# EasyEDA Pro project EasyEDA.epro

# Schematic Schematic1
Board Name: Board1; Create Date: 2025-05-21; Page Name: P1; Project Name: FM_Transmitter; Schematic Name: Schematic1; Update Date: 2025-06-13; Company: EasyEDA.com; Page Size: A4; Version: V1.0
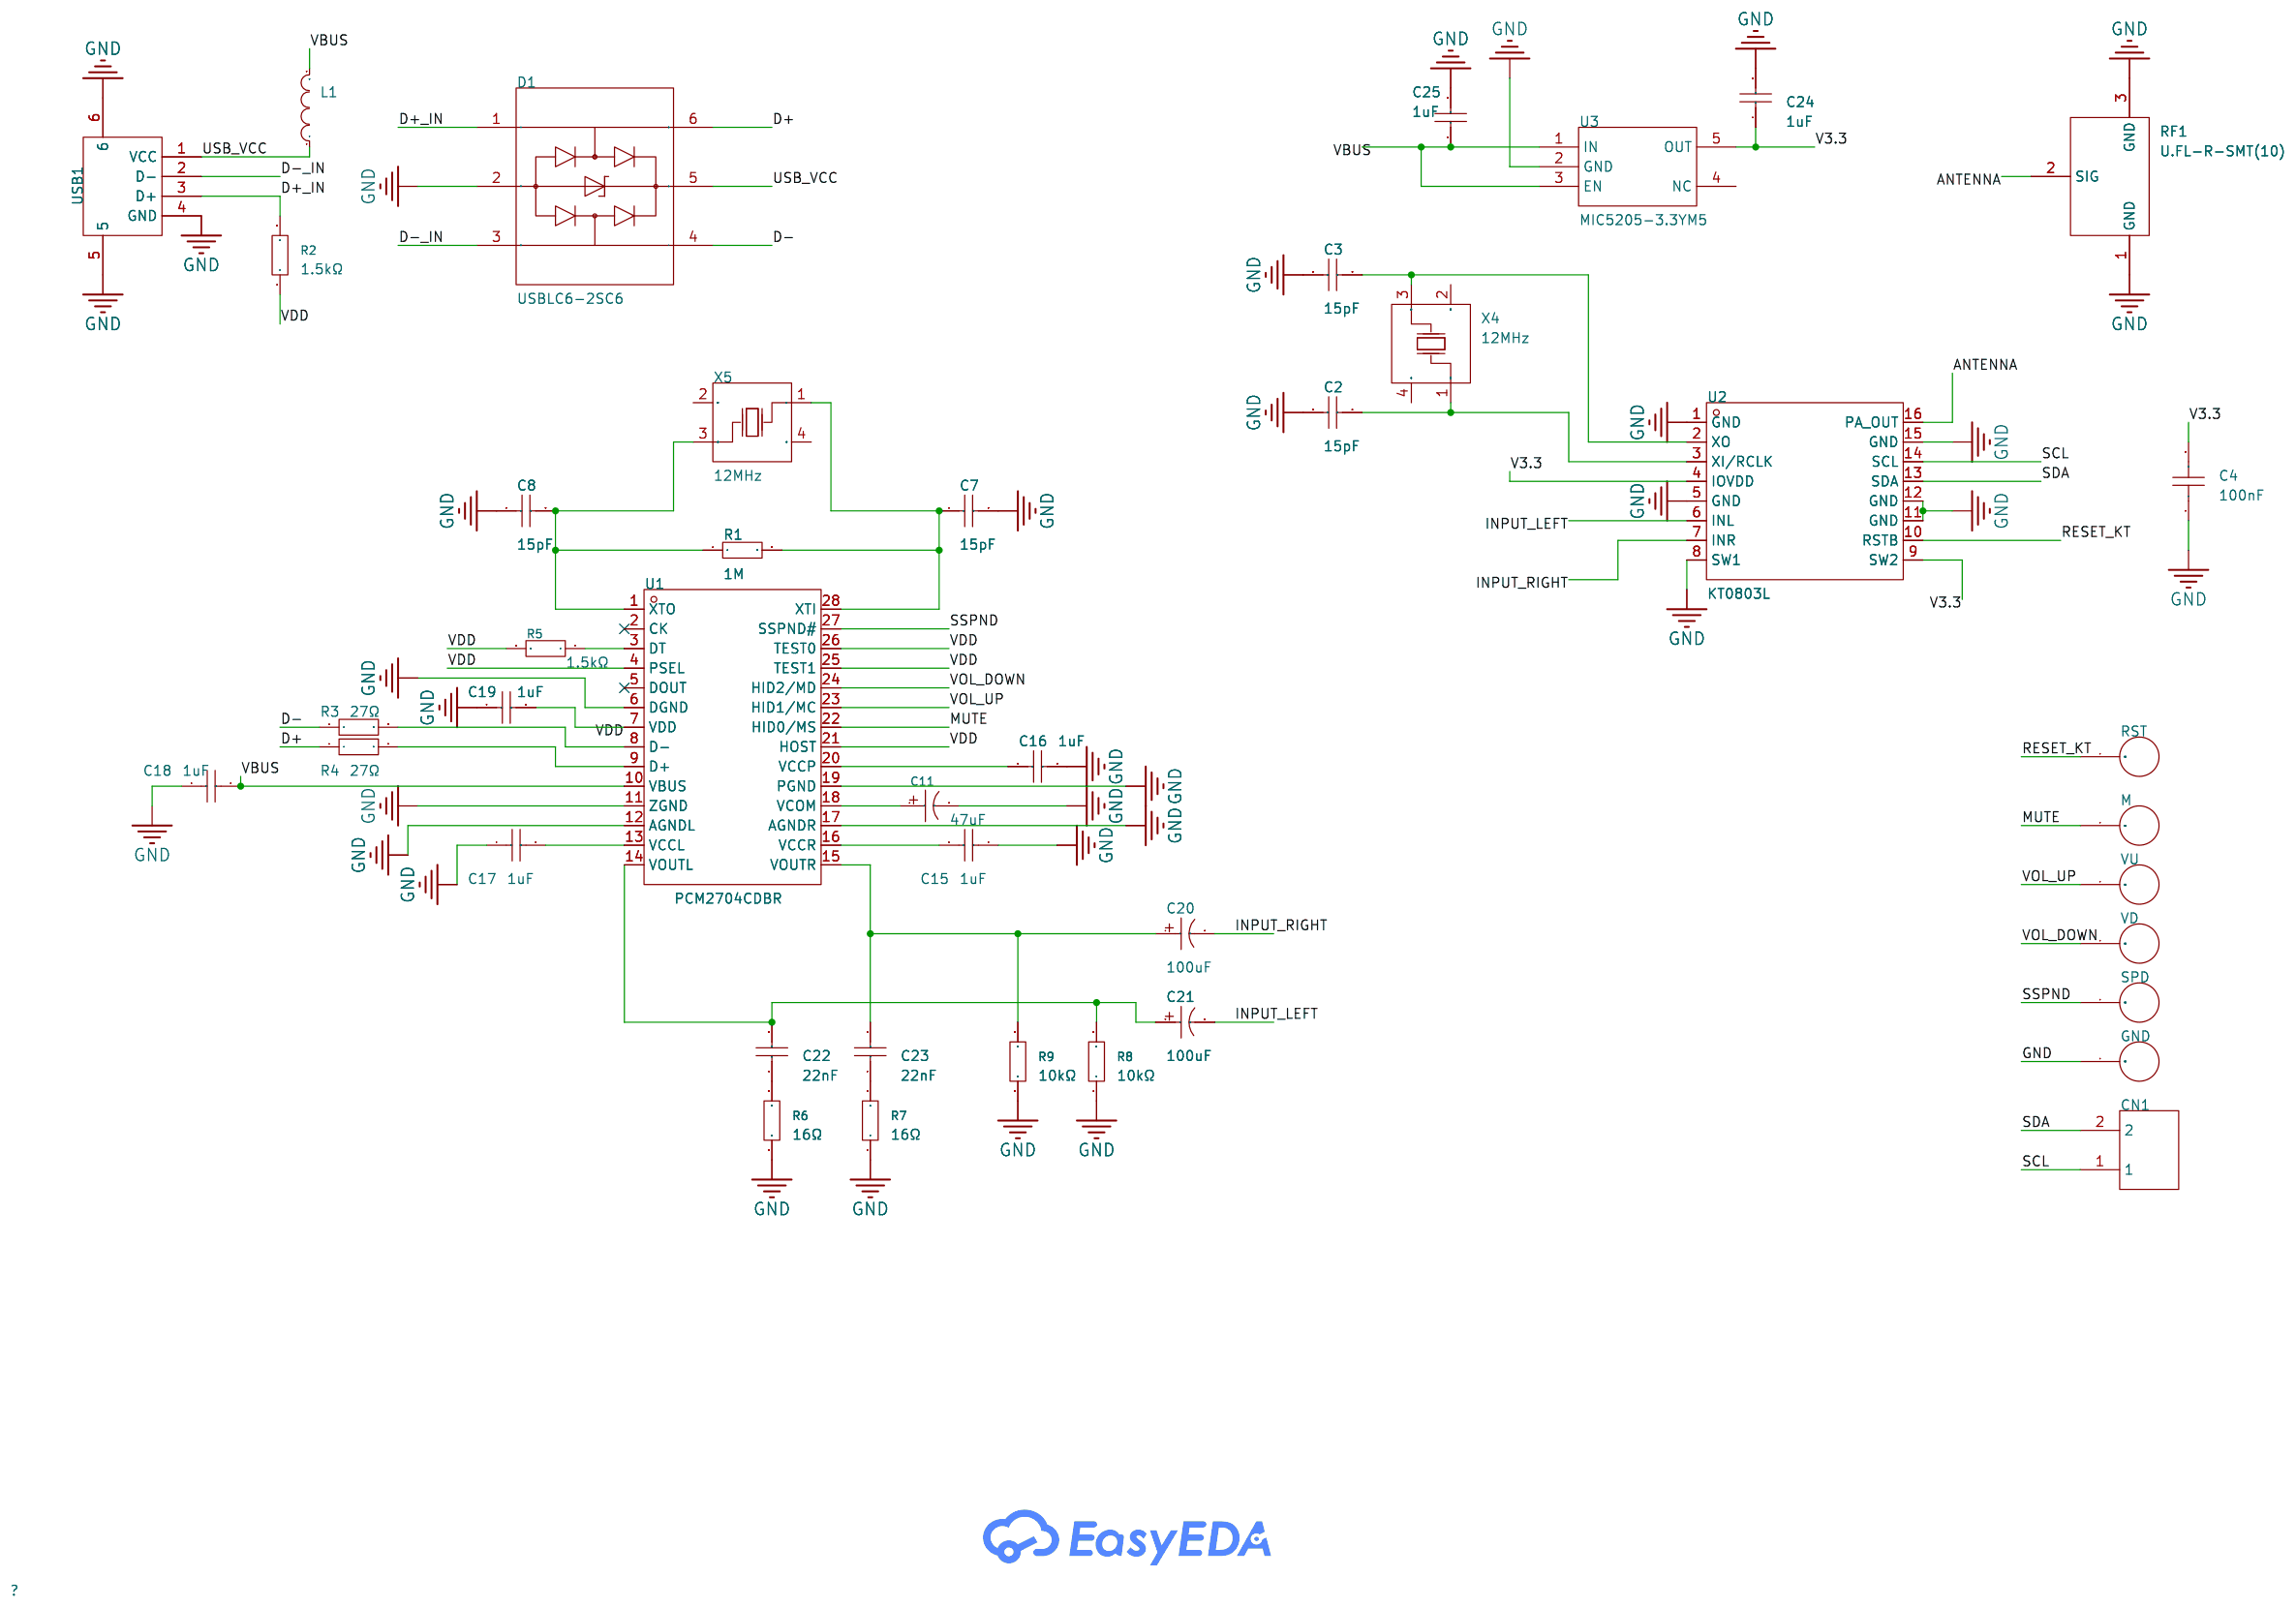
[diagram p0: schematic sheet]

## Parts
C2  15pF  [C0805]
C3  15pF  [C0805]
C4  100nF  [C0805]
C7  15pF  [C0805]
C8  15pF  [C0805]
C11  47uF  [CAP-SMD_BD5.0-L5.3-W5.3-FD]
C15  1uF  [C0805]
C16  1uF  [C0805]
C17  1uF  [C0805]
C18  1uF  [C0805]
C19  1uF  [C0805]
C20  100uF  [CAP-SMD_BD5.0-L5.3-W5.3-FD]
C21  100uF  [CAP-SMD_BD5.0-L5.3-W5.3-FD]
C22  22nF  [C0805]
C23  22nF  [C0805]
C24  1uF  [C0805]
C25  1uF  [C0805]
CN1  B2B-PH-K-S(LF)(SN)  [CONN-TH_B2B-PH-K-S]
D1  USBLC6-2SC6  [SOT-23-6_L2.9-W1.6-P0.95-LS2.8-BL]
GND  -  [TEST PAD]  (no BOM)
L1  MPZ1608S101ATAH0  [L0805]
M  -  [TEST PAD]  (no BOM)
R1  1M  [R0806]
R2  1.5kΩ  [R0806]
R3  27Ω  [R0806]
R4  27Ω  [R0806]
R5  1.5kΩ  [R0806]
R6  16Ω  [R0806]
R7  16Ω  [R0806]
R8  10kΩ  [R0806]
R9  10kΩ  [R0806]
RF1  U.FL-R-SMT(10)  [ANT-SMD_UFL-R-SMT01]
RST  -  [TEST PAD]  (no BOM)
SPD  -  [TEST PAD]  (no BOM)
U1  PCM2704CDBR  [SSOP-28_L10.2-W5.3-P0.65-LS7.8-BL]
U2  KT0803L  [SOP-16_L9.9-W3.9-P1.27-LS6.0-BL]
U3  MIC5205-3.3YM5  [SOT-23-5_L2.9-W1.6-P0.95-LS2.8-BR]
USB1  U-G-O4DD-W-1  [USB-A-TH_U-G-04WD-W-01]
VD  -  [TEST PAD]  (no BOM)
VU  -  [TEST PAD]  (no BOM)
X4  12MHz  [CRYSTAL-SMD_4P-L3.2-W2.5-TL]
X5  12MHz  [CRYSTAL-SMD_4P-L3.2-W2.5-TL]

## Library data of the parts
C2 C3 C7 C8 = 0402CG150J500NT: Capacitance: Tolerance:±5% Tolerance:±5% Voltage Rated: Temperature Coefficient:; LCSC Part Name: 15pF ±5% 50V; Supplier Part: C1548; Manufacturer: FH(风华); Supplier Footprint: 0402; JLCPCB Part Class: Basic Part; Datasheet: https://atta.szlcsc.com/upload/public/pdf/source/20200305/C486355_26A10D38EF8C2A5C37091D0039909270.pdf; Supplier: LCSC; Tolerance: ±5%
C4 = CL05B104KO5NNNC: Capacitance: Tolerance:±10% Tolerance:±10% Voltage Rated: Temperature Coefficient:; LCSC Part Name: 100nF ±10% 16V; Supplier Part: C1525; Manufacturer: SAMSUNG(三星); Supplier Footprint: 0402; JLCPCB Part Class: Basic Part; Datasheet: https://atta.szlcsc.com/upload/public/pdf/source/20160218/1457707763339.pdf; Supplier: LCSC; Tolerance: ±10%
C11 = RVT1C470M0505: Capacitance: Tolerance:±20% Tolerance:±20% Rated Voltage: Ripple Current:- Equivalent Series Resistance(ESR):- φD: L: Lifetime @ Temp:2000hrs@105℃ Operating Temperature:-55℃~+105℃ Operating Temperature:-55℃~+105℃; LCSC Part Name: 47uF ±20% 16V; Supplier Part: C3337; Manufacturer: HONOR(荣誉); Supplier Footprint: SMD,D5xL5.4mm; JLCPCB Part Class: Extended Part; Datasheet: https://atta.szlcsc.com/upload/public/pdf/source/20170602/1496384426683.pdf; Supplier: LCSC; Tolerance: ±20%; Lifetime @ Temp: 2000hrs@105℃; Operating Temperature: -55℃~+105℃
C15-C19 C24 C25 = CL10A105KO8NNNC: Capacitance: Tolerance:±10% Tolerance:±10% Voltage Rated: Temperature Coefficient:; LCSC Part Name: 1uF ±10% 16V; Supplier Part: C1592; Manufacturer: SAMSUNG(三星); Supplier Footprint: 0603; JLCPCB Part Class: Extended Part; Datasheet: https://atta.szlcsc.com/upload/public/pdf/source/20220919/9FBE606BE0D9532D730F292EB26DC5BB.pdf; Supplier: LCSC; Tolerance: ±10%
C20 C21 = RVT1E101M0607: Capacitance:100uF Tolerance:±20% Tolerance:±20% Voltage Rating:25V Ripple Current:- Equivalent Series Resistance(ESR):- Diameter:6.3mm Height - Seated (Max):7.7mm Lifetime:2000hrs@105℃ Operating Temperature:-55℃~+105℃ Operating Temperature:-55℃~+105℃; LCSC Part Name: 100uF ±20% 25V; Supplier Part: C3338; Manufacturer: HONOR(荣誉); Supplier Footprint: SMD,D6.3xL7.7mm; JLCPCB Part Class: Extended Part; Datasheet: https://atta.szlcsc.com/upload/public/pdf/source/20250304/8AEF5A10740A8CC68A04B0B0B1D3A755.pdf; Supplier: LCSC; Tolerance: ±20%; Voltage Rating: 25V; Diameter: 6.3mm; Height - Seated (Max): 7.7mm; Lifetime: 2000hrs@105℃; Operating Temperature: -55℃~+105℃
C22 C23 = 0402B223K500NT: Capacitance:22nF Tolerance:±10% Tolerance:±10% Voltage Rating:50V Temperature Coefficient:X7R; LCSC Part Name: 22nF ±10% 50V; Supplier Part: C1532; Manufacturer: FH(风华); Supplier Footprint: 0402; Datasheet: https://atta.szlcsc.com/upload/public/pdf/source/20200305/C486355_26A10D38EF8C2A5C37091D0039909270.pdf; Supplier: LCSC; Tolerance: ±10%; Voltage Rating: 50V; Temperature Coefficient: X7R
CN1 = B2B-PH-K-S(LF)(SN): Pins Structure:1x2P Pitch:2mm Mounting Type:Direct Insert Reference Series:PH Number of Pins:2P Number of Rows:1 Number of PINs Per Row:2 Row Spacing:- Current Rating:2A Contact Material:Brass Contact Plating:Tin Operating Temperature:-25℃~+85℃ Operating; LCSC Part Name: 1x2P 间距:2mm 直插 系列:PH; Supplier Part: C131337; Manufacturer: JST; Supplier Footprint: 插件,P=2mm; JLCPCB Part Class: Extended Part; Datasheet: https://atta.szlcsc.com/upload/public/pdf/source/20171026/C131342_15089839687311058815.pdf; Supplier: LCSC; Pins Structure: 1x2P; Pitch: 2mm; Mounting Type: Direct Insert; Reference Series: PH; Number of Pins: 2P; Number of Rows: 1; Number of PINs Per Row: 2; Current Rating: 2A; Contact Material: Brass; Contact Plating: Tin; Operating Temperature: -25℃~+85℃; Voltage Rating: 100V; Plastic Material: PA66; Flame Retardant Rating: UL94V-0; Supplementary Features: K-leg punch; Color: White; Z-Height of the Board: 6mm; X-Length of Bottom Edge on Board (Spacing Line): 5.9mm; Y-Width of Bottom Edge on Board: 4.5mm
D1 = USBLC6-2SC6: Reverse Stand-Off Voltage (Vrwm):5V Maximum Clamping Voltage:20V Peak Pulse Current (Ipp)@10/1000us:5A Breakdown Voltage:6V Type:ESD; LCSC Part Name: ESD二极管 USBLC6-2SC6; Supplier Part: C323793; Supplier Footprint: SOT-23-6; JLCPCB Part Class: Extended Part; Datasheet: https://atta.szlcsc.com/upload/public/pdf/source/20181029/C323793_48F7908330A3F84485333C8DC43F9E49.pdf; Supplier: LCSC; Reverse Stand-Off Voltage (Vrwm): 5V; Maximum Clamping Voltage: 20V; Peak Pulse Current (Ipp)@10/1000us: 5A; Breakdown Voltage: 6V; Type: ESD
GND M RST SPD VD VU = TEST PAD
L1 = MPZ1608S101ATAH0: Impedance @ Frequency:100Ω@100MHz Tolerance:±25% Tolerance:±25% DC Resistance:30mΩ Current Rating:3A Circuits:1; LCSC Part Name: 单路 0603磁珠 阻抗100Ω@100MHz; Supplier Part: C107332; Manufacturer: TDK; Supplier Footprint: 0603; JLCPCB Part Class: Extended Part; Datasheet: https://atta.szlcsc.com/upload/public/pdf/source/20170420/1492670791787.pdf; Supplier: LCSC; Impedance @ Frequency: 100Ω@100MHz; Tolerance: ±25%; DC Resistance: 30mΩ; Current Rating: 3A; Circuits: 1
R1 = 1M: link: https://item.szlcsc.com/323315.html; 3DModel: R0402_L1.0-W0.5-H0.5; Supplier: LCSC; Manufacturer: UniOhm; Manufacturer Part: 0402WGF1004TCE; Supplier Part: C26083; JLCPCB Part Class: Basic
R2 R5 = 0402WGF1501TCE: Type:Thick Film Resistors Resistance:1.5kΩ Tolerance:±1% Tolerance:±1% Power(Watts): Overload Voltage (Max): Temperature Coefficient:±100ppm/℃ Temperature Coefficient:±100ppm/℃ Operating Temperature Range:-55℃~+155℃ Operating Temperature Range:-55℃~+155℃; LCSC Part Name: 1.5kΩ ±1% 62.5mW 厚膜电阻; Supplier Part: C25867; Manufacturer: UNI-ROYAL(厚声); Supplier Footprint: 0402; JLCPCB Part Class: Basic Part; Datasheet: https://atta.szlcsc.com/upload/public/pdf/source/20200306/C422600_1E6D84923E4A46A82E41ADD87F860B5C.pdf; Supplier: LCSC; Type: Thick Film Resistors; Tolerance: ±1%; Temperature Coefficient: ±100ppm/℃; Operating Temperature Range: -55℃~+155℃
R3 R4 = 0402WGF270JTCE: Type:Thick Film Resistors Resistance:27Ω Tolerance:±1% Tolerance:±1% Power(Watts): Overload Voltage (Max): Temperature Coefficient:±100ppm/℃ Temperature Coefficient:±100ppm/℃ Operating Temperature Range:-55℃~+155℃ Operating Temperature Range:-55℃~+155℃; LCSC Part Name: 27Ω ±1% 62.5mW 厚膜电阻; Supplier Part: C25100; Manufacturer: UNI-ROYAL(厚声); Supplier Footprint: 0402; JLCPCB Part Class: Extended Part; Datasheet: https://atta.szlcsc.com/upload/public/pdf/source/20200306/C422600_1E6D84923E4A46A82E41ADD87F860B5C.pdf; Supplier: LCSC; Type: Thick Film Resistors; Tolerance: ±1%; Temperature Coefficient: ±100ppm/℃; Operating Temperature Range: -55℃~+155℃
R6 R7 = 0603WAF160JT5E: Type:Thick Film Resistors Resistance:16Ω Tolerance:±1% Tolerance:±1% Power(Watts): Overload Voltage (Max): Temperature Coefficient:±100ppm/℃ Temperature Coefficient:±100ppm/℃ Operating Temperature Range:-55℃~+155℃ Operating Temperature Range:-55℃~+155℃; LCSC Part Name: 16Ω ±1% 100mW 厚膜电阻; Supplier Part: C25185; Manufacturer: UNI-ROYAL(厚声); Supplier Footprint: 0603; JLCPCB Part Class: Extended Part; Datasheet: https://atta.szlcsc.com/upload/public/pdf/source/20200306/C422600_1E6D84923E4A46A82E41ADD87F860B5C.pdf; Supplier: LCSC; Type: Thick Film Resistors; Tolerance: ±1%; Temperature Coefficient: ±100ppm/℃; Operating Temperature Range: -55℃~+155℃
R8 R9 = 0402WGJ0103TCE: Type:Thick Film Resistors Resistance:10kΩ Tolerance:±5% Tolerance:±5% Power(Watts): Overload Voltage (Max): Temperature Coefficient:±100ppm/℃ Temperature Coefficient:±100ppm/℃ Operating Temperature Range:-55℃~+155℃ Operating Temperature Range:-55℃~+155℃; LCSC Part Name: 10kΩ ±5% 62.5mW 厚膜电阻; Supplier Part: C25531; Manufacturer: UNI-ROYAL(厚声); Supplier Footprint: 0402; JLCPCB Part Class: Extended Part; Datasheet: https://atta.szlcsc.com/upload/public/pdf/source/20200306/C422600_1E6D84923E4A46A82E41ADD87F860B5C.pdf; Supplier: LCSC; Type: Thick Film Resistors; Tolerance: ±5%; Temperature Coefficient: ±100ppm/℃; Operating Temperature Range: -55℃~+155℃
RF1 = U.FL-R-SMT(10): Connector Type:板端 Interface Type:内针 Number of Ports:1 Interface Diameter:2mm Interface Length/Height:1.25mm Frequency-Max:6GHz RF Series:IPEX Impedance:50Ω Style:- Contact Material:Brass Operating Temperature Range:-40℃~+90℃ Operating Temperature Range:-4; LCSC Part Name: IPEX 内针; Supplier Part: C434808; Manufacturer: HRS(广濑); Supplier Footprint: SMD; JLCPCB Part Class: Extended Part; Datasheet: https://atta.szlcsc.com/upload/public/pdf/source/20191010/C434816_11DAC26C7ED37A2D3E584E7DBDF6972E.pdf; Supplier: LCSC; Connector Type: 板端; Interface Type: 内针; Number of Ports: 1; Interface Diameter: 2mm; Interface Length/Height: 1.25mm; Frequency-Max: 6GHz; RF Series: IPEX; Impedance: 50Ω; Contact Material: Brass; Operating Temperature Range: -40℃~+90℃
U1 = PCM2704CDBR: Resolution:16 Number of Channels:- Voltage - Supply:3V~5.25V Voltage - Supply:3V~5.25V Interface Type:USB；SPI Operating Temperature:-25℃~+85℃ Operating Temperature:-25℃~+85℃; Supplier Part: C2859784; Manufacturer: TI(德州仪器); Supplier Footprint: SSOP-28-208mil; JLCPCB Part Class: Extended Part; Datasheet: https://www.ti.com/cn/lit/gpn/pcm2706c; Supplier: LCSC; Resolution: 16; Voltage - Supply: 3V~5.25V; Interface Type: USB；SPI; Operating Temperature: -25℃~+85℃
U2 = KT0803L: Supplier Part: C9900105795; Supplier Footprint: SOP16; JLCPCB Part Class: Extended Part; Supplier: LCSC
U3 = MIC5205-3.3YM5: Output Type:Fixed Voltage - Supply:20V Output Voltage:3.3V Output Voltage:3.3V Output Current:150mA Power Supply Rejection Ratio (PSRR):70dB@(1kHz) Operating Temperature:-40℃~+125℃@(Tj) Operating Temperature:-40℃~+125℃@(Tj) Output Configuration:Positive e; LCSC Part Name: 线性稳压器(LDO); Supplier Part: C20617303; Manufacturer: TECH PUBLIC(台舟); Supplier Footprint: SOT-23-5; JLCPCB Part Class: Extended Part; Datasheet: https://atta.szlcsc.com/upload/public/pdf/source/20240202/BF02EA9B20BC582DB45A13FA3EA98D4D.pdf; Supplier: LCSC; Output Type: Fixed; Voltage - Supply: 20V; Output Voltage: 3.3V; Output Current: 150mA; Power Supply Rejection Ratio (PSRR): 70dB@(1kHz); Operating Temperature: -40℃~+125℃@(Tj); Output Configuration: Positive electrode; Number of Outputs: 1
USB1 = U-G-O4DD-W-1: Connector Type:Type-A Standard:USB 2.0 Gender:公 Number of Ports:1 Number of Contacts:4P Current Rating - Power (Max):1A; LCSC Part Name: Type-A 公; Supplier Part: C98125; Manufacturer: 韩国韩荣; Supplier Footprint: 插件; JLCPCB Part Class: Extended Part; Datasheet: https://atta.szlcsc.com/upload/public/pdf/source/20190321/C98125_6153EFB71EE46DEADFAFF2A82C946B59.pdf; Supplier: LCSC; Connector Type: Type-A; Standard: USB 2.0; Gender: 公; Number of Ports: 1; Number of Contacts: 4P; Current Rating - Power (Max): 1A
X4 X5 = X322512MSB4SI: Crystal Type:Surface Mount Crystal Frequency: Normal temperature Frequency Tolerance:±10ppm Normal temperature Frequency Tolerance:±10ppm External load capacitor: Frequency Stability(Full temperature range):±20ppm Frequency Stability(Full temperature rang; LCSC Part Name: 12MHz ±10ppm 20pF; Supplier Part: C9002; Manufacturer: YXC(扬兴晶振); Supplier Footprint: SMD3225-4P; JLCPCB Part Class: Basic Part; Datasheet: https://atta.szlcsc.com/upload/public/pdf/source/20240329/19D5F850207469550BEB00D7DFEDBC7A.pdf; Supplier: LCSC; Crystal Type: Surface Mount Crystal; Normal temperature Frequency Tolerance: ±10ppm; Frequency Stability(Full temperature range): ±20ppm

## Nets
GND: C2.1 C3.1 C4.1 C7.2 C8.1 C11.2 C15.2 C16.2 C17.1 C18.1 C19.1 C24.2 C25.2 D1.2 GND.1(TEST_PAD1) R6.1 R7.1 R8.1 R9.1 RF1.1(GND) RF1.3(GND) U1.6(DGND) U1.11(ZGND) U1.12(AGNDL) U1.17(AGNDR) U1.19(PGND) U2.1(GND) U2.5(GND) U2.8(SW1) U2.11(GND) U2.12(GND) U2.15(GND) U3.2(GND) USB1.4(GND) USB1.5 USB1.6
V3.3: C4.2 C24.1 U2.4(IOVDD) U2.9(SW2) U3.5(OUT)
VBUS: C18.2 C25.1 L1.2 U1.10(VBUS) U3.1(IN) U3.3(EN)
VDD: C19.2 R2.1 R5.2 U1.4(PSEL) U1.7(VDD) U1.21(HOST) U1.25(TEST1) U1.26(TEST0)
ANTENNA: RF1.2(SIG) U2.16(PA_OUT)
D+: D1.6 R4.1
D+_IN: D1.1 R2.2 USB1.3(D+)
D-: D1.4 R3.1
D-_IN: D1.3 USB1.2(D-)
INPUT_LEFT: C21.2 U2.6(INL)
INPUT_RIGHT: C20.2 U2.7(INR)
MUTE: M.1(TEST_PAD1) U1.22(HID0/MS)
RESET_KT: RST.1(TEST_PAD1) U2.10(RSTB)
SCL: CN1.1 U2.14(SCL)
SDA: CN1.2 U2.13(SDA)
SSPND: SPD.1(TEST_PAD1) U1.27(SSPND#)
USB_VCC: D1.5 L1.1 USB1.1(VCC)
VOL_DOWN: U1.24(HID2/MD) VD.1(TEST_PAD1)
VOL_UP: U1.23(HID1/MC) VU.1(TEST_PAD1)
$1N1057: C3.2 U2.2(XO) X4.3(OSC2)
$1N1062: C2.2 U2.3(XI/RCLK) X4.1(OSC1)
$1N1861: C7.1 R1.2 U1.28(XTI) X5.1(OSC1)
$1N1867: C8.2 R1.1 U1.1(XTO) X5.3(OSC2)
$1N2251: C16.1 U1.20(VCCP)
$1N2376: C11.1 U1.18(VCOM)
$1N2424: C15.1 U1.16(VCCR)
$1N2491: C17.2 U1.13(VCCL)
$1N2905: R4.2 U1.9(D+)
$1N2912: R3.2 U1.8(D-)
$1N3054: R5.1 U1.3(DT)
$1N3574: C22.1 R6.2
$1N3613: C23.1 R7.2
$1N3658: C20.1 C23.2 R9.2 U1.15(VOUTR)
$1N3676: C21.1 C22.2 R8.2 U1.14(VOUTL)

Not connected (* = marked no-connect by the designer): U1 2(CK)* 5(DOUT)*; U3 4(NC); X4 2(GND) 4(GND); X5 2(GND) 4(GND)

# Board PCB1
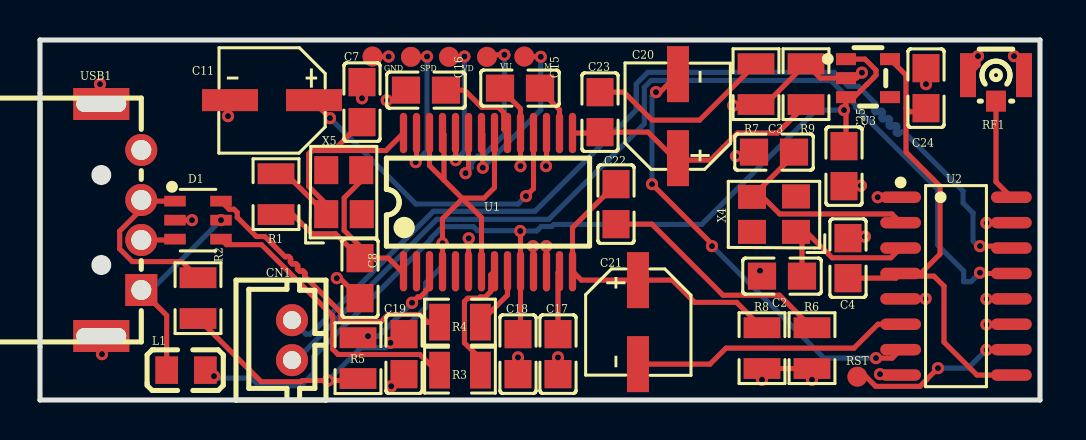
[diagram p1: board, top side]
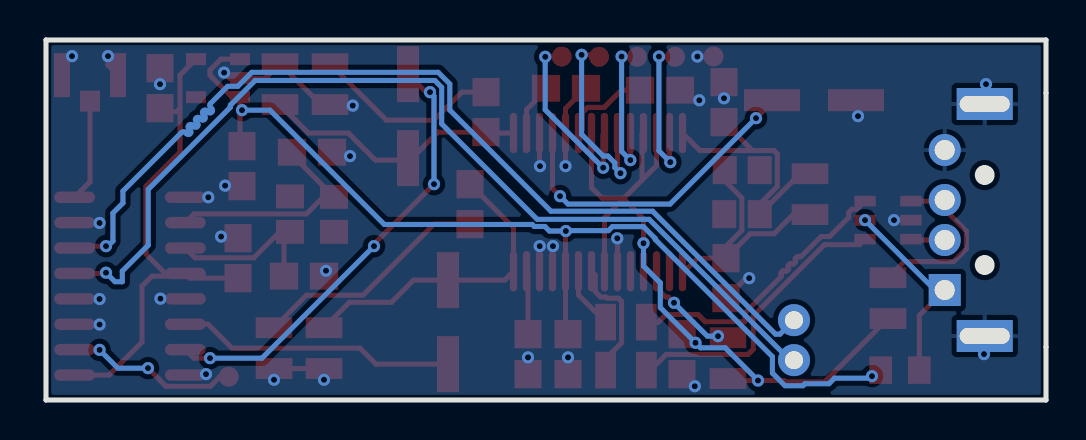
[diagram p2: board, bottom side, seen from below]

Outline 50 x 18 mm; copper layers: Top Layer, Bottom Layer. Coordinates in mm from the lower left corner of the outline.
Outline path: 0,15.35 0,18 50,18 50,0 0,0 0,2.65
Stack: Top Layer 0.035mm / Dielectric1 1.51mm FR4 er 4.5 / Bottom Layer 0.035mm

## Design rules (mm)
net SCL: DP2
net SDA: DP2
net D-: DP1
net D+: DP1
template: JLCPCB Capability(Two Layers Board)
spacing copperThickness1oz (default): track to track 0.102, other pairs 0.152 to 0.3
spacing copperThickness2oz: track to track 0.203, other pairs 0.152 to 0.3
track width copperThickness1oz (default): min 0.127, default 0.254, max 2.54
track width copperThickness2oz: min 0.203, default 0.254, max 2.54
differential pair differentialPair (default): width min 0.127, default 0.254, max 2.54; gap min 0.152, default 0.152
via viaSize (default): diameter min 0.5, default 0.61, max 10; hole min 0.3, default 0.305, max 6.3

## Placement (name value [footprint] x y rotation side)
C2  15pF  [C0805]  37.1 6.19 0 top
C3  15pF  [C0805]  36.7 12.39 0 top
C4  100nF  [C0805]  40.4 7.09 270 top
C7  15pF  [C0805]  16.1 14.89 90 top
C8  15pF  [C0805]  16 6.09 90 top
C11  47uF  [CAP-SMD_BD5.0-L5.3-W5.3-FD]  11.6 14.99 180 top
C15  1uF  [C0805]  24 15.59 180 top
C16  1uF  [C0805]  19.3 15.49 180 top
C17  1uF  [C0805]  25.9 2.29 90 top
C18  1uF  [C0805]  23.9 2.29 90 top
C19  1uF  [C0805]  18.2 2.29 90 top
C20  100uF  [CAP-SMD_BD5.0-L5.3-W5.3-FD]  31.9 14.19 90 top
C21  100uF  [CAP-SMD_BD5.0-L5.3-W5.3-FD]  29.9 3.89 270 top
C22  22nF  [C0805]  28.8 9.79 90 top
C23  22nF  [C0805]  28 14.39 270 top
C24  1uF  [C0805]  44.3 15.59 90 top
C25  1uF  [C0805]  40.2 11.69 270 top
CN1  B2B-PH-K-S(LF)(SN)  [CONN-TH_B2B-PH-K-S]  12.6 2.99 90 top
D1  USBLC6-2SC6  [SOT-23-6_L2.9-W1.6-P0.95-LS2.8-BL]  7.9 8.99 270 top
GND  -  [TEST PAD]  16.62 17.17 90 top
L1  MPZ1608S101ATAH0  [L0805]  7.3 1.49 0 top
M  -  [TEST PAD]  24.21 17.17 90 top
R1  1M  [R0806]  11.8 10.29 90 top
R2  1.5kΩ  [R0806]  7.9 5.09 90 top
R3  27Ω  [R0806]  21 1.49 0 top
R4  27Ω  [R0806]  21 3.89 0 top
R5  1.5kΩ  [R0806]  15.9 2.09 270 top
R6  16Ω  [R0806]  38.6 2.59 90 top
R7  16Ω  [R0806]  35.8 15.79 90 top
R8  10kΩ  [R0806]  36.1 2.59 90 top
R9  10kΩ  [R0806]  38.3 15.79 270 top
RF1  U.FL-R-SMT(10)  [ANT-SMD_UFL-R-SMT01]  47.8 15.59 180 top
RST  -  [TEST PAD]  40.87 1.17 0 top
SPD  -  [TEST PAD]  18.55 17.16 90 top
U1  PCM2704CDBR  [SSOP-28_L10.2-W5.3-P0.65-LS7.8-BL]  22.4 9.89 0 top
U2  KT0803L  [SOP-16_L9.9-W3.9-P1.27-LS6.0-BL]  45.8 5.69 270 top
U3  MIC5205-3.3YM5  [SOT-23-5_L2.9-W1.6-P0.95-LS2.8-BR]  41.4 16.09 180 top
USB1  U-G-O4DD-W-1  [USB-A-TH_U-G-04WD-W-01]  4.06 9 270 top
VD  -  [TEST PAD]  20.45 17.16 90 top
VU  -  [TEST PAD]  22.35 17.16 90 top
X4  12MHz  [CRYSTAL-SMD_4P-L3.2-W2.5-TL]  36.7 9.29 180 top
X5  12MHz  [CRYSTAL-SMD_4P-L3.2-W2.5-TL]  15.2 10.39 90 top

## Footprints (pads in the part's own frame, mm; a bottom-side part is the same pattern mirrored in y, then rotated)
ANT-SMD_UFL-R-SMT01
  rect 0.8x2.2 smd: 1(-1.4,-0.65) 3(1.4,-0.65)
  rect 1x1.05 smd: 2(0,0.65)
C0805
  rect 1.41x1.35 smd: 1(-1,0) 2(1,0)
CAP-SMD_BD5.0-L5.3-W5.3-FD
  rect 2.8x1.1 smd: 1(-2.1,0) 2(2.1,0)
CONN-TH_B2B-PH-K-S
  round 1.6 hole 0.9: 1(1,0) 2(-1,0)
CRYSTAL-SMD_4P-L3.2-W2.5-TL
  rect 1.4x1.2 smd: 1(-1.1,0.887) 2(1.1,0.887) 3(1.1,-0.863) 4(-1.1,-0.887)
L0805
  rect 1.133x1.377 smd: 1(-0.966,0) 2(0.966,0)
R0806
  rect 1.04x1.836 smd: 1(-1.02,0) 2(1.02,0)
SOP-16_L9.9-W3.9-P1.27-LS6.0-BL
  oval 0.574x2.038 smd: 1(-4.445,-2.769) 2(-3.175,-2.769) 3(-1.905,-2.769) 4(-0.635,-2.769) 5(0.635,-2.769) 6(1.905,-2.769) 7(3.175,-2.769) 8(4.445,-2.769) 9(4.445,2.769) 10(3.175,2.769) 11(1.905,2.769) 12(0.635,2.769) 13(-0.635,2.769) 14(-1.905,2.769) 15(-3.175,2.769) 16(-4.445,2.769)
SOT-23-5_L2.9-W1.6-P0.95-LS2.8-BR
  rect 1x0.6 smd: 1(1.1,-0.95) 2(1.1,0) 3(1.1,0.95) 4(-1.1,0.95) 5(-1.1,-0.95)
SOT-23-6_L2.9-W1.6-P0.95-LS2.8-BL
  rect 0.532x1.072 smd: 1(-0.95,-1.149) 2(0,-1.149) 3(0.95,-1.149) 4(0.95,1.149) 5(0,1.149) 6(-0.95,1.149)
SSOP-28_L10.2-W5.3-P0.65-LS7.8-BL
  oval 0.364x2.015 smd: 1(-4.225,-3.455) 2(-3.575,-3.455) 3(-2.925,-3.455) 4(-2.275,-3.455) 5(-1.625,-3.455) 6(-0.975,-3.455) 7(-0.325,-3.455) 8(0.325,-3.455) 9(0.975,-3.455) 10(1.625,-3.455) 11(2.275,-3.455) 12(2.925,-3.455) 13(3.575,-3.455) 14(4.225,-3.455) 15(4.225,3.455) 16(3.575,3.455) 17(2.925,3.455) 18(2.275,3.455) 19(1.625,3.455) 20(0.975,3.455) 21(0.325,3.455) 22(-0.325,3.455) 23(-0.975,3.455) 24(-1.625,3.455) 25(-2.275,3.455) 26(-2.925,3.455) 27(-3.575,3.455) 28(-4.225,3.455)
TEST PAD
  round 1 smd: 1(0,0)
USB-A-TH_U-G-04WD-W-01
  rect 1.6x1.6 hole 1: 1(3.5,1)
  round 1.6 hole 1: 2(1,1) 3(-1,1) 4(-3.5,1)
  rect 1.6x2.8 hole 0.8x2.5: 5(5.8,-1) 6(-5.8,-1)

## Nets
As in the schematic.

Pads without a net: U1 2 5; U3 4; X4 2 4; X5 2 4

## Via types
v1: diameter 0.61, hole 0.305, Top Layer to Bottom Layer, 60 vias

## Routing (per net, layer and track width the routed paths; a pad name or vN(x,y) marks a point on that pad's centre or on a via; arc(x,y) is an arc through that point)
GND: length 33.9
  Top Layer w0.254: C25.2 41.02,10.69 v1(41.04,10.72) ; v1(14.84,6.09) 15,6.09 C8.1 ; C17.1 v1(25.9,2.13) ; RF1.1 49.2,16.69 v1(48.7,17.19) ; D1.2 v1(7.6,8.99) ; U1.6 21.43,8.07 v1(21.44,8.08) ; U1.11 24.68,7.67 v1(24.65,7.69) ; v1(25.31,7.69) 25.32,7.68 25.32,6.44 ; v1(41.1,16.37) 40.82,16.09 U3.2 39.02,16.09 R9.1 36.26,14.77 R7.1 35.75,14.72 v1(34.66,14.72) ; RF1.3 46.9,16.74 v1(46.9,17.19) ; v1(17.43,17.17) GND.1 ; C3.1 35.5,12.19 v1(34.8,12.19) ; v1(24.03,11.69) U1.19 24.03,14.57 C15.2 ; 9.4,14.99 v1(9.4,14.19) ; U2.1 v1(41.89,10.14) ; C24.2 v1(44.3,15.79) ; v1(41.25,8.17) 41.17,8.09 C4.1 ; 25.32,13.35 25.32,11.72 v1(25.3,11.69) ; R6.1 R8.1 ; v1(23.9,2.13) C18.1 ; C7.2 v1(16.1,15.09)
  vias: v1(3,15.79) v1(3.1,2.29) v1(17.34,14.99) v1(17.56,0.69) v1(36,6.46) v1(36.1,1.01) v1(38.6,1.01) v1(42,1.29) v1(44.28,5.07) v1(47.32,8.85) v1(47.32,5.05) v1(47.32,3.77)
V3.3: length 26.3
  Top Layer w0.254: C4.2 42.8,6.09 U2.4 ; 43.3,14.59 43.3,12.39 45,10.69 45,7.29 44.03,6.33 U2.4 ; 43.3,14.59 43.3,16.24 U3.5 ; 43.3,14.59 43.48,14.41 44.12,14.41 C24.1 ; U2.4 43.17,6.19 44.7,6.19 45.2,5.69 45.2,2.89 46.84,1.25 48.57,1.25
VBUS: length 49.9
  Top Layer w0.254: 40.3,14.59 U3.3 40.7,15.14 41.33,15.77 41.34,15.77 41.68,16.11 41.68,16.12 41.8,16.24 41.8,16.49 41.25,17.04 U3.1 ; 40.3,14.59 40.3,12.79 C25.1 ; 40.3,14.59 v1(40.2,14.49) ; C18.2 24.03,3.42 U1.10 24.03,8.43 v1(24.01,8.45)
  Bottom Layer w0.254: v1(40.2,14.49) 38.8,14.49 33.08,8.78 25.69,8.78 25.59,8.68 25.06,8.68 24.83,8.45 v1(24.01,8.45) 23.81,8.45 23.79,8.47 21.88,8.47 21.68,8.67 20.13,8.67 19.54,8.08 19.54,8.03 13.68,2.17 13.68,1.35 13.05,0.71 12.15,0.71 12.05,0.81 10.85,0.81 10.57,1.09 8.8,1.09 v1(8.7,1.19)
VDD: length 39.2
  Top Layer w0.254: R2.1 11.06,0.91 13.05,0.91 13.11,0.97 v1(14.4,0.97) 15.8,0.97 R5.2 ; 20.2,10.99 21.1,10.09 ; 20.2,10.99 20.2,13.27 U1.25 ; 20.2,10.99 19.47,11.72 U1.26 ; 21.1,10.09 22.2,10.09 22.72,10.62 U1.21 ; 21.1,10.09 21.12,10.07 ; U1.4 v1(20.12,7.84) 20.12,9.07 21.12,10.07 ; v1(17.52,2.86) 17.77,2.86 C19.2 ; 21.12,10.07 22.07,9.12 U1.7
  Bottom Layer w0.254: v1(20.12,7.84) 20.12,6.7 19.28,5.86 19.28,4.62 v1(17.52,2.86) 17.27,2.61 16.04,2.61 v1(14.4,0.97)
ANTENNA: length 5.1
  Top Layer w0.254: 48.57,10.14 47.8,10.91 RF1.2
D+: length 14.6
  Top Layer w0.254: R4.1 19.37,3.89 18.99,4.28 17.41,4.28 17.04,3.91 15.08,3.91 15.05,3.95 15.05,4.37 13.24,6.17 arc(13.22,6.22) 13.24,6.27 arc(13.26,6.32) 13.24,6.37 13.16,6.45 arc(13.11,6.47) 13.06,6.45 arc(13.01,6.43) 12.97,6.45 12.88,6.53 arc(12.86,6.58) 12.88,6.63 arc(12.91,6.68) 12.88,6.73 12.8,6.81 arc(12.75,6.83) 12.71,6.81 arc(12.66,6.79) 12.61,6.81 12.53,6.89 arc(12.5,6.94) 12.53,6.99 arc(12.55,7.04) 12.53,7.09 12.45,7.17 arc(12.4,7.19) 12.35,7.17 arc(12.3,7.15) 12.25,7.17 11.24,8.17 10.82,8.17 9.86,9.13 9.86,9.37 9.7,9.54 9.45,9.54 D1.6
D+_IN: length 9.1
  Top Layer w0.254: D1.1 5.12,9.94 USB1.3 5.06,9.53 3.98,8.45 3.98,7.55 4.62,6.92 7.09,6.92 R2.2
D-: length 14.6
  Top Layer w0.254: D1.4 9.32,7.77 11.07,7.77 14.64,4.2 14.64,2.54 14.9,2.28 18.99,2.28 19.77,1.49 R3.1
D-_IN: length 1.7
  Top Layer w0.254: D1.3 6.71,8 USB1.2
INPUT_LEFT: length 14
  Top Layer w0.254: U2.6 41.9,3.79 40.7,2.59 34.3,2.59 33.5,1.79 C21.2
INPUT_RIGHT: length 22.3
  Top Layer w0.254: 31.8,16.19 31,15.39 v1(30.8,15.39) ; v1(33.6,7.69) 33.6,7.79 v1(30.6,10.79) ; v1(41.8,2.09) 42.61,2.09 U2.7
  Bottom Layer w0.254: v1(30.8,15.39) 30.6,15.19 v1(30.6,10.79) ; v1(33.6,7.69) 39.2,2.09 v1(41.8,2.09)
MUTE: length 9.3
  Top Layer w0.254: v1(22.14,11.61) 22.14,13.28 U1.22 ; M.1 25.03,17.17 v1(25.04,17.16)
  Bottom Layer w0.254: v1(22.14,11.61) 25.04,14.51 v1(25.04,17.16)
RESET_KT: length 8.7
  Top Layer w0.254: v1(44.9,1.59) 44.33,1.02 44.33,1.01 44,0.68 41.78,0.68 41.3,1.17 RST.1 ; v1(47.32,2.51) 48.56,2.51 48.57,2.52
  Bottom Layer w0.254: v1(47.32,2.51) 46.41,1.59 v1(44.9,1.59)
SCL: length 49.2
  Top Layer w0.254: v1(47,7.69) 48.47,7.69 48.57,7.6
  Bottom Layer w0.254: v1(47,7.69) 46.91,7.69 46.65,7.95 46.65,9.35 46.15,9.85 46.15,10.45 43.22,13.38 arc(43.13,13.42) 43.04,13.38 42.97,13.31 arc(42.79,13.31) 42.79,13.49 42.86,13.56 arc(42.86,13.74) 42.68,13.74 42.61,13.67 arc(42.43,13.67) 42.43,13.85 42.5,13.92 arc(42.5,14.1) 42.32,14.1 42.25,14.03 arc(42.07,14.03) 42.07,14.21 42.14,14.28 arc(42.14,14.46) 41.96,14.46 41.89,14.39 arc(41.71,14.39) 41.71,14.57 41.78,14.64 arc(41.82,14.73) 41.78,14.82 40.92,15.68 40.41,15.68 39.71,16.38 30.39,16.38 29.81,15.8 29.81,14.5 24.75,9.44 19.67,9.44 13.53,3.29 13.3,3.29 CN1.1
SDA: length 49.2
  Top Layer w0.254: 48.57,6.33 47.04,6.33 v1(47,6.36)
  Bottom Layer w0.254: CN1.2 12.8,1.99 19.84,9.03 25.44,9.03 30.22,13.81 30.22,15.63 30.56,15.98 39.54,15.98 40.78,14.73 40.78,14.63 44.89,10.53 44.89,7.74 46.18,6.45 46.18,5.92 46.19,5.91 46.55,5.91 v1(47,6.36)
SSPND: length 7.8
  Top Layer w0.254: 18.82,13.35 18.82,11.93 v1(18.79,11.89) ; SPD.1 19.34,17.16 v1(19.35,17.17)
  Bottom Layer w0.254: v1(19.35,17.17) 19.35,12.46 v1(18.79,11.89)
USB_VCC: length 10
  Top Layer w0.254: L1.1 6.33,4.23 USB1.1
  Bottom Layer w0.254: USB1.1 5.56,5.5 v1(9.05,8.99)
VOL_DOWN: length 7.5
  Top Layer w0.254: v1(20.78,11.99) 20.78,13.34 U1.24 ; v1(21.22,17.17) 21.21,17.16 VD.1
  Bottom Layer w0.254: v1(21.22,17.17) 21.22,12.43 v1(20.78,11.99)
VOL_UP: length 9.8
  Top Layer w0.254: U1.23 21.43,11.49 v1(21.28,11.34) ; VU.1 22.45,17.26 v1(23.22,17.26)
  Bottom Layer w0.254: v1(21.28,11.34) 21.56,11.62 21.56,11.85 21.9,12.2 22.13,12.2 23.22,13.28 v1(23.22,17.26)
$1N1057: length 11.1
  Top Layer w0.254: C3.2 37.7,12.26 X4.3 36.13,10.16 36.98,9.3 42.6,9.3 U2.2
$1N1062: length 8.3
  Top Layer w0.254: U2.3 42.54,7.11 39.61,7.11 38.31,8.41 X4.1 38.1,8.11 C2.2
$1N1861: length 13.9
  Top Layer w0.254: R1.2 12.29,11.31 X5.1 14.31,9.8 13.43,10.68 13.43,12.31 13.6,12.47 14.68,12.47 ; U1.28 17.3,12.47 14.68,12.47 ; 14.68,12.47 C7.1
$1N1867: length 12.7
  Top Layer w0.254: C8.2 16,7.69 15.21,8.48 15.21,10.11 16,10.9 16,11.43 X5.3 ; C8.2 17.42,7.09 18.18,6.34 ; C8.2 14.78,8.31 13.6,8.31 12.64,9.27 R1.1
$1N2251: length 4.5
  Top Layer w0.254: C16.1 21.23,15.49 21.92,14.81 21.92,14.8 22.08,14.63 22.92,14.63 23.19,14.36 23.19,13.54 U1.20
$1N2376: length 16.3
  Top Layer w0.254: 13.6,14.99 v1(14.5,14.09) ; U1.18 24.68,10.57 v1(24.3,10.19)
  Bottom Layer w0.254: v1(24.3,10.19) 23.9,9.8 18.8,9.8 v1(14.5,14.09)
$1N2424: length 2.7
  Top Layer w0.254: U1.16 25.97,14.52 24.9,15.59
$1N2491: length 3.2
  Top Layer w0.254: C17.2 25.9,6.36 U1.13
$1N2905: length 3.1
  Top Layer w0.254: R4.2 23.38,5.25 U1.9
$1N2912: length 6.4
  Top Layer w0.254: U1.8 22.54,6.25 22.54,5.42 22.27,5.15 22.02,5.15 21.96,5.09 21.38,5.09 21.22,4.93 21.22,2.86 22.02,2.06 R3.2
$1N3054: length 4.9
  Top Layer w0.254: U1.3 19.47,5.67 19.29,5.48 19.29,5.42 19.02,5.15 18.89,5.15 v1(18.6,4.86)
  Bottom Layer w0.254: v1(18.6,4.86) 16.93,3.19 v1(16.4,3.19)
$1N3574: length 11.9
  Top Layer w0.254: R6.2 36.97,5.24 34.15,5.24 30.6,8.79 C22.1
$1N3613: length 9.5
  Top Layer w0.254: R7.2 32.98,13.99 30.6,13.99 29.2,15.39 C23.1
$1N3658: length 13.4
  Top Layer w0.254: R9.2 36.87,13.35 34.88,13.35 33.53,11.99 31.8,11.99 30.4,13.39 C23.2 27.96,13.35 U1.15
$1N3676: length 15.9
  Top Layer w0.254: C22.2 26.62,8.62 U1.14 27.07,5.99 C21.1 31.62,5.99 32.73,4.88 34.83,4.88 R8.2

## Copper pours and planes (outline as drawn; the poured copper is in the pictures)
GND on Top Layer: -0.4,18.39 50.4,18.39 50.4,-0.31 -0.4,-0.31
GND on Bottom Layer: -0.6,18.29 50.7,18.29 50.7,-0.21 -0.6,-0.21
